# Altium schematic sheet Sheet1.SchDoc
size A
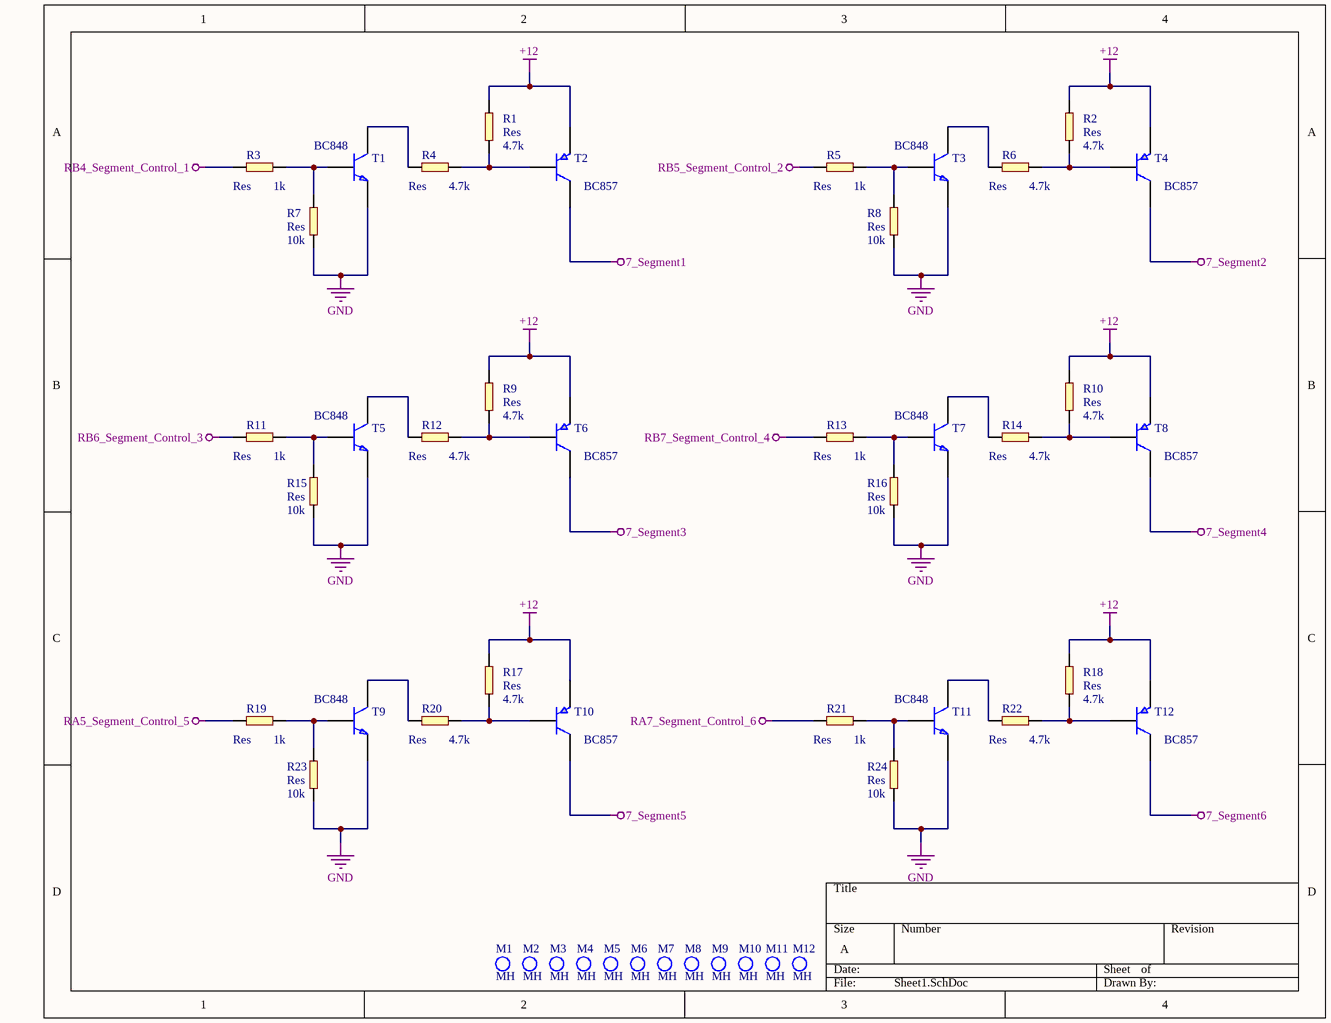
[diagram p0: Sheet1.SchDoc]

## Parts
M1  MH  [Mounting hole]
M2  MH  [Mounting hole]
M3  MH  [Mounting hole]
M4  MH  [Mounting hole]
M5  MH  [Mounting hole]
M6  MH  [Mounting hole]
M7  MH  [Mounting hole]
M8  MH  [Mounting hole]
M9  MH  [Mounting hole]
M10  MH  [Mounting hole]
M11  MH  [Mounting hole]
M12  MH  [Mounting hole]
R1  Res  value 4.7k  [RES0805]
R2  Res  value 4.7k  [RES0805]
R3  Res  value 1k  [RES0805]
R4  Res  value 4.7k  [RES0805]
R5  Res  value 1k  [RES0805]
R6  Res  value 4.7k  [RES0805]
R7  Res  value 10k  [RES0805]
R8  Res  value 10k  [RES0805]
R9  Res  value 4.7k  [RES0805]
R10  Res  value 4.7k  [RES0805]
R11  Res  value 1k  [RES0805]
R12  Res  value 4.7k  [RES0805]
R13  Res  value 1k  [RES0805]
R14  Res  value 4.7k  [RES0805]
R15  Res  value 10k  [RES0805]
R16  Res  value 10k  [RES0805]
R17  Res  value 4.7k  [RES0805]
R18  Res  value 4.7k  [RES0805]
R19  Res  value 1k  [RES0805]
R20  Res  value 4.7k  [RES0805]
R21  Res  value 1k  [RES0805]
R22  Res  value 4.7k  [RES0805]
R23  Res  value 10k  [RES0805]
R24  Res  value 10k  [RES0805]
T1  BC848  [SOT23]
T2  BC857  [SOT23]
T3  BC848  [SOT23]
T4  BC857  [SOT23]
T5  BC848  [SOT23]
T6  BC857  [SOT23]
T7  BC848  [SOT23]
T8  BC857  [SOT23]
T9  BC848  [SOT23]
T10  BC857  [SOT23]
T11  BC848  [SOT23]
T12  BC857  [SOT23]

## Nets
7_Segment1: T2.3(C)
7_Segment2: T4.3(C)
7_Segment3: T6.3(C)
7_Segment4: T8.3(C)
7_Segment5: T10.3(C)
7_Segment6: T12.3(C)
+12: R1.2(b) R2.2(b) R9.2(b) R10.2(b) R17.2(b) R18.2(b) T2.2(E) T4.2(E) T6.2(E) T8.2(E) T10.2(E) T12.2(E)
GND: R7.2(b) R8.2(b) R15.2(b) R16.2(b) R23.2(b) R24.2(b) T1.2(E) T3.2(E) T5.2(E) T7.2(E) T9.2(E) T11.2(E)
RA5_Segment_Control_5: R19.2(b)
RA7_Segment_Control_6: R21.2(b)
RB4_Segment_Control_1: R3.2(b)
RB5_Segment_Control_2: R5.2(b)
RB6_Segment_Control_3: R11.2(b)
RB7_Segment_Control_4: R13.2(b)
NetR1_1: R1.1(a) R4.1(a) T2.1(B)
NetR2_1: R2.1(a) R6.1(a) T4.1(B)
NetR3_1: R3.1(a) R7.1(a) T1.1(B)
NetR4_2: R4.2(b) T1.3(C)
NetR5_1: R5.1(a) R8.1(a) T3.1(B)
NetR6_2: R6.2(b) T3.3(C)
NetR9_1: R9.1(a) R12.1(a) T6.1(B)
NetR10_1: R10.1(a) R14.1(a) T8.1(B)
NetR11_1: R11.1(a) R15.1(a) T5.1(B)
NetR12_2: R12.2(b) T5.3(C)
NetR13_1: R13.1(a) R16.1(a) T7.1(B)
NetR14_2: R14.2(b) T7.3(C)
NetR17_1: R17.1(a) R20.1(a) T10.1(B)
NetR18_1: R18.1(a) R22.1(a) T12.1(B)
NetR19_1: R19.1(a) R23.1(a) T9.1(B)
NetR20_2: R20.2(b) T9.3(C)
NetR21_1: R21.1(a) R24.1(a) T11.1(B)
NetR22_2: R22.2(b) T11.3(C)

## Library data of the parts
R1-R24 = Resistor: Res0805
T1 T3 T5 T7 T9 T11 = BC848: TRANSISTOR